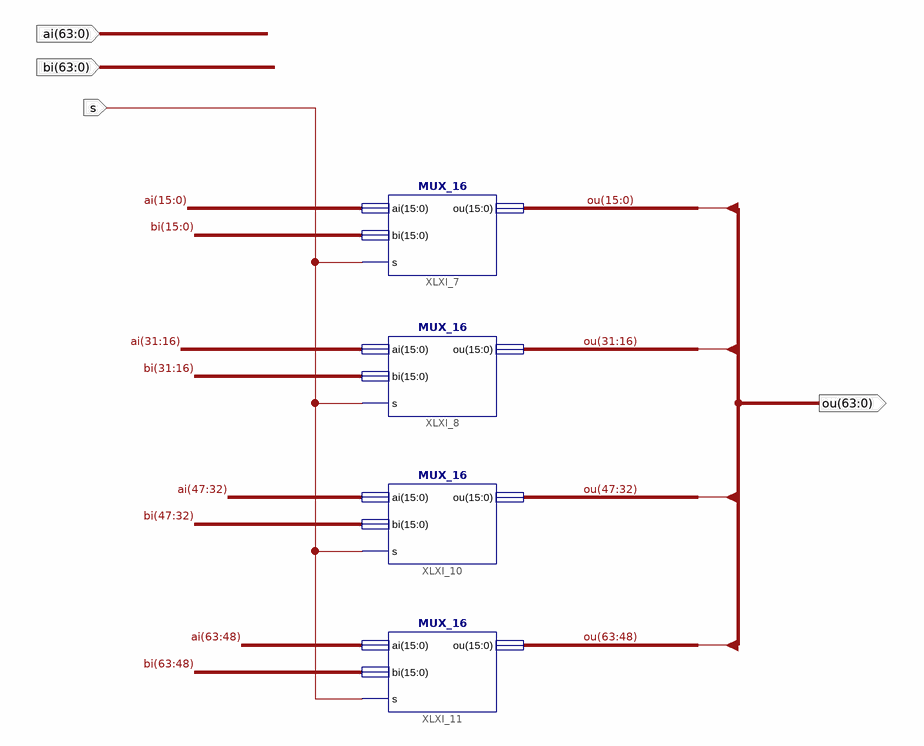
[diagram p0: schematic sheet 1]
// Xilinx ISE schematic MUX_64.sch (kintex7) as structural Verilog: 4 symbols, 4 ports
module MUX_64 (
  input  [63:0] ai,
  input  [63:0] bi,
  input  s,
  output [63:0] ou
);

  MUX_16 XLXI_7 (.ai(ai[15:0]), .bi(bi[15:0]), .s(s), .ou(ou[15:0]));
  MUX_16 XLXI_8 (.ai(ai[31:16]), .bi(bi[31:16]), .s(s), .ou(ou[31:16]));
  MUX_16 XLXI_10 (.ai(ai[47:32]), .bi(bi[47:32]), .s(s), .ou(ou[47:32]));
  MUX_16 XLXI_11 (.ai(ai[63:48]), .bi(bi[63:48]), .s(s), .ou(ou[63:48]));
endmodule
